# Altium schematic sheet inverter.SchDoc
size A
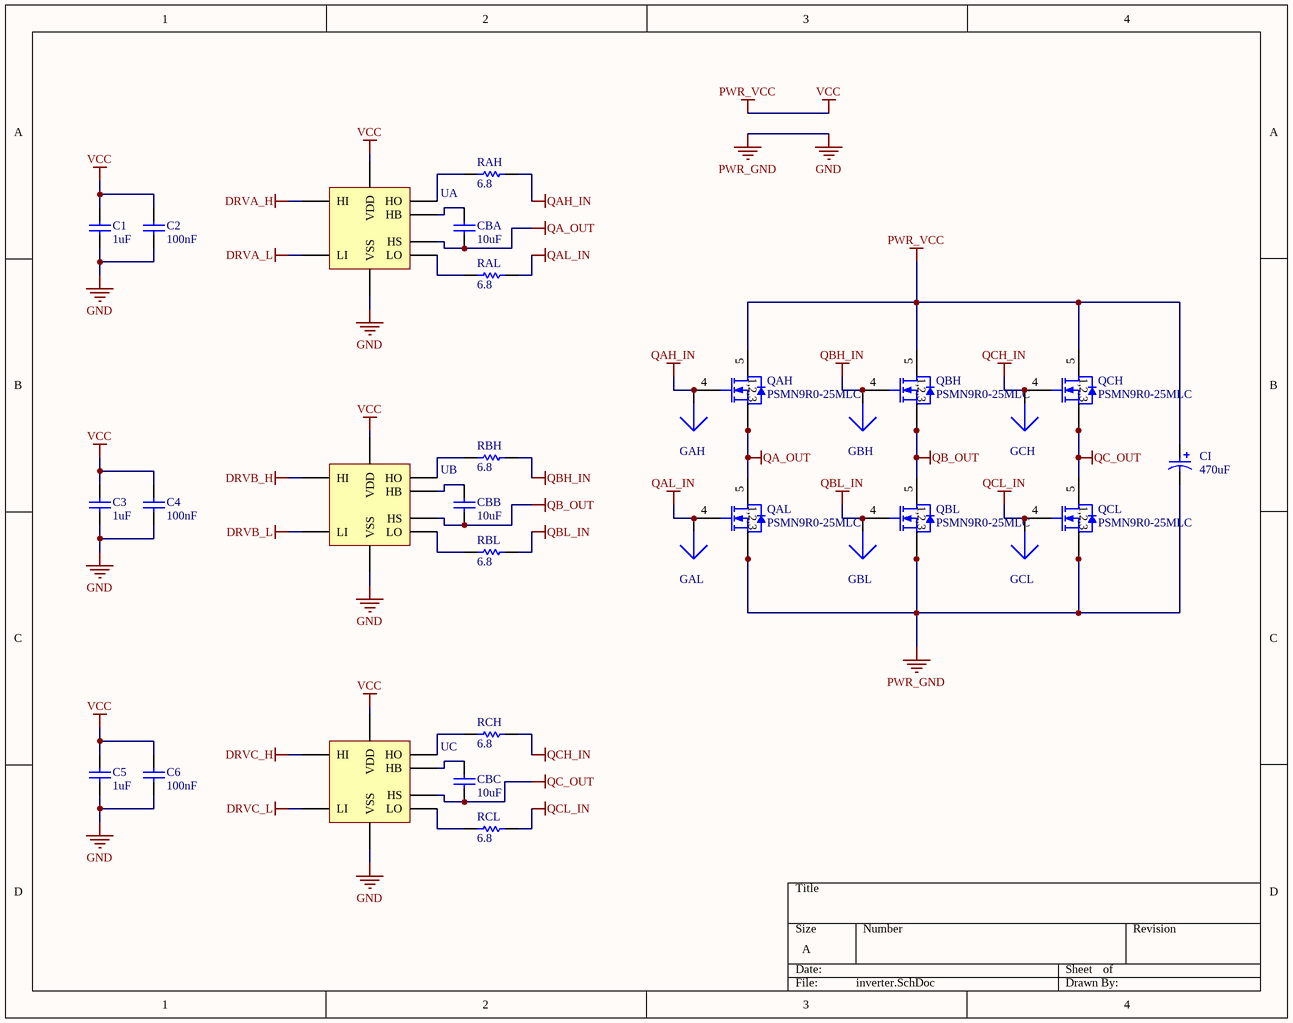
[diagram p0: inverter.SchDoc]

## Parts
C1  1uF  [CAPC1608L]
C2  100nF  [CAPC1608L]
C3  1uF  [CAPC1608L]
C4  100nF  [CAPC1608L]
C5  1uF  [CAPC1608L]
C6  100nF  [CAPC1608L]
CBA  10uF  [CAPC3216L]
CBB  10uF  [CAPC3216L]
CBC  10uF  [CAPC3216L]
CI  470uF  [CAP_RADIAL-CAN_SMD_M10]
GAH  TESTPOINT-ARROW-BLUE  [TESTP_PAD_.75mm]  (value not drawn)
GAL  TESTPOINT-ARROW-BLUE  [TESTP_PAD_.75mm]  (value not drawn)
GBH  TESTPOINT-ARROW-BLUE  [TESTP_PAD_.75mm]  (value not drawn)
GBL  TESTPOINT-ARROW-BLUE  [TESTP_PAD_.75mm]  (value not drawn)
GCH  TESTPOINT-ARROW-BLUE  [TESTP_PAD_.75mm]  (value not drawn)
GCL  TESTPOINT-ARROW-BLUE  [TESTP_PAD_.75mm]  (value not drawn)
QAH  value PSMN9R0-25MLC  [x-NXP_LFPAK33]
QAL  value PSMN9R0-25MLC  [x-NXP_LFPAK33]
QBH  value PSMN9R0-25MLC  [x-NXP_LFPAK33]
QBL  value PSMN9R0-25MLC  [x-NXP_LFPAK33]
QCH  value PSMN9R0-25MLC  [x-NXP_LFPAK33]
QCL  value PSMN9R0-25MLC  [x-NXP_LFPAK33]
RAH  6.8  [RESC1608L]
RAL  6.8  [RESC1608L]
RBH  6.8  [RESC1608L]
RBL  6.8  [RESC1608L]
RCH  6.8  [RESC1608L]
RCL  6.8  [RESC1608L]
UA  UCC27201A  [x-TI_S-PVSON-N9]  (value not drawn)
UB  UCC27201A  [x-TI_S-PVSON-N9]  (value not drawn)
UC  UCC27201A  [x-TI_S-PVSON-N9]  (value not drawn)

## Nets
DRVA_H: UA.6(HI)
DRVA_L: UA.7(LI)
DRVB_H: UB.6(HI)
DRVB_L: UB.7(LI)
DRVC_H: UC.6(HI)
DRVC_L: UC.7(LI)
GND: C1.2 C2.2 C3.2 C4.2 C5.2 C6.2 CI.2 QAL.1(S) QAL.2(S) QAL.3(S) QBL.1(S) QBL.2(S) QBL.3(S) QCL.1(S) QCL.2(S) QCL.3(S) UA.8(VSS) UB.8(VSS) UC.8(VSS)  [also labelled PWR_GND]
PWR_VCC: C1.1 C2.1 C3.1 C4.1 C5.1 C6.1 CI.1 QAH.5(D) QBH.5(D) QCH.5(D) UA.1(VDD) UB.1(VDD) UC.1(VDD)  [also labelled VCC]
QA_OUT: CBA.2 QAH.1(S) QAH.2(S) QAH.3(S) QAL.5(D) UA.4(HS)
QAH_IN: GAH.1 QAH.4(G) RAH.1
QAL_IN: GAL.1 QAL.4(G) RAL.1
QB_OUT: CBB.2 QBH.1(S) QBH.2(S) QBH.3(S) QBL.5(D) UB.4(HS)
QBH_IN: GBH.1 QBH.4(G) RBH.1
QBL_IN: GBL.1 QBL.4(G) RBL.1
QC_OUT: CBC.2 QCH.1(S) QCH.2(S) QCH.3(S) QCL.5(D) UC.4(HS)
QCH_IN: GCH.1 QCH.4(G) RCH.1
QCL_IN: GCL.1 QCL.4(G) RCL.1
NetCBA_1: CBA.1 UA.2(HB)
NetCBB_1: CBB.1 UB.2(HB)
NetCBC_1: CBC.1 UC.2(HB)
NetRAH_2: RAH.2 UA.3(HO)
NetRAL_2: RAL.2 UA.9(LO)
NetRBH_2: RBH.2 UB.3(HO)
NetRBL_2: RBL.2 UB.9(LO)
NetRCH_2: RCH.2 UC.3(HO)
NetRCL_2: RCL.2 UC.9(LO)

## Notes on the sheet
- (in symbol PSMN9R0-25MLC) 1,2,3

## Library data of the parts
C1 C3 C5 = CAP_1u_0603_25V_X5R_10%: CAP CER 1UF 25V 10% X5R 0603; Manufacturer Part Number: TMK107BJ105KA-T; Name: CAP_1u_0603_25V_X5R_10%; Value: 1uF; Supplier 1: Digi-Key; Supplier Part Number 1: 587-1248-1-ND
C2 C4 C6 = CAP_100n_0603_50V_Y5V: CAP CER 0.1UF 50V Y5V 0603; Manufacturer Part Number: CC0603ZRY5V9BB104; Name: CAP_100n_0603_50V_Y5V; Value: 100nF; Supplier 1: Digi-Key; Supplier Part Number 1: 311-1343-1-ND
CBA CBB CBC = CAP_10u_1206_25V_Y5V: CAP CER 10UF 25V Y5V 1206; Manufacturer Part Number: TMK316F106ZL-T; Name: CAP_10u_1206_25V_Y5V; Value: 10uF; Supplier 1: Digi-Key; Supplier Part Number 1: 587-1353-1-ND
CI = CAP_E_470u_Dia10_25V_Al_20%: CAP ALUM 470UF 25V 20% SMD; Manufacturer: Nichicon; Manufacturer Part Number: UCW1E471MNL1GS; Name: CAP_E_470u_Dia10_25V_Al_20%; Value: 470uF; Supplier 1: Digi-Key; Supplier Part Number 1: 493-9424-1-ND
GAH GAL GBH GBL GCH GCL = TESTP_PAD_.75mm: Round Test Point on Board; Value: 0.75mm; Name: TESTP_PAD_.75mm
QAH QAL QBH QBL QCH QCL = PSMN9R0-25MLC: TRANSISTOR MOSFET N-CHANN 25V 8.6MOHM; Manufacturer: NXP Semiconductors; Manufacturer Part Number: PSMN9R0-25MLC,115; Name: PSMN9R0-25MLC; Supplier 1: Digi-Key; Supplier Part Number 1: 568-9578-1-ND
RAH RAL RBH RBL RCH RCL = RES_6R8_0603_0W1_1%: RES 6.8 OHM 1/10W 1% 0603; Manufacturer: Stackpole Electronics Inc; Manufacturer Part Number: RMCF0603FT6R80; Name: RES_6R8_0603_0W1_1%; Value: 6.8; Supplier 1: Digi-Key; Supplier Part Number 1: RMCF0603FT6R80CT-ND
UA UB UC = x-TI_UCC27201A: IC DVR HIGH/LOW SIDE 3A 9SON; Manufacturer: Texas Instruments; Manufacturer Part Number: UCC27201ADRCT; Name: x-TI_UCC27201A; Supplier 1: Digi-Key; Supplier Part Number 1: 296-30051-2-ND